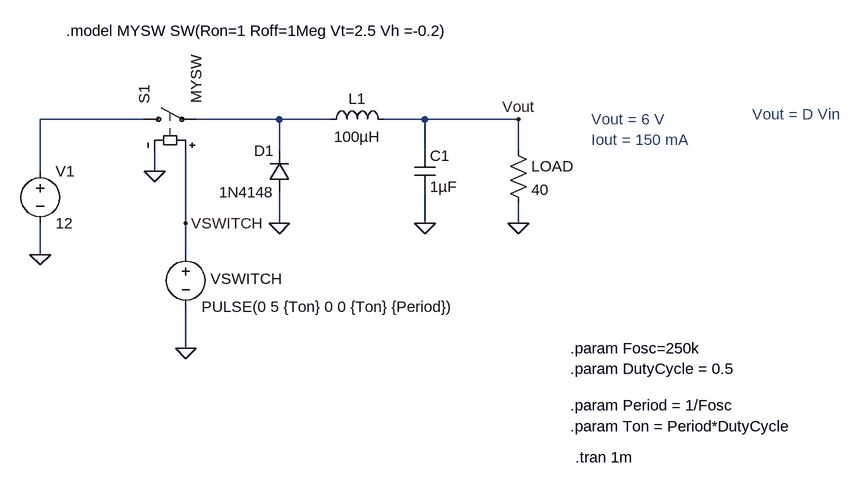
[diagram p0: schematic Buck (Step-Down) Converter Design.asc]
Buck (Step-Down) Converter Design.asc, the LTspice schematic file:
Version 4
SHEET 1 1188 680
WIRE 80 96 -80 96
WIRE 288 96 160 96
WIRE 368 96 288 96
WIRE 512 96 448 96
WIRE 656 96 512 96
WIRE 288 144 288 96
WIRE 512 144 512 96
WIRE 656 144 656 96
WIRE -80 176 -80 96
WIRE 96 176 96 144
WIRE 144 256 144 144
WIRE 288 256 288 208
WIRE 512 256 512 208
WIRE 656 256 656 224
WIRE -80 304 -80 256
WIRE 144 304 144 256
WIRE 144 448 144 384
FLAG -80 304 0
FLAG 96 176 0
FLAG 144 448 0
FLAG 288 256 0
FLAG 512 256 0
FLAG 656 256 0
FLAG 656 96 Vout
FLAG 144 256 VSWITCH
SYMBOL voltage -80 160 R0
WINDOW 123 0 0 Left 0
WINDOW 39 0 0 Left 0
SYMATTR InstName V1
SYMATTR Value 12
SYMBOL sw 64 96 R270
SYMATTR InstName S1
SYMATTR Value MYSW
SYMBOL voltage 144 288 R0
WINDOW 0 38 53 Left 2
WINDOW 123 0 0 Left 0
WINDOW 39 0 0 Left 0
SYMATTR InstName VSWITCH
SYMATTR Value PULSE(0 5 {Ton} 0 0 {Ton} {Period})
SYMBOL ind 352 112 R270
WINDOW 0 32 56 VTop 2
WINDOW 3 5 56 VBottom 2
SYMATTR InstName L1
SYMATTR Value 100µH
SYMBOL diode 304 208 R180
WINDOW 0 24 64 Left 2
WINDOW 3 24 0 Left 2
SYMATTR InstName D1
SYMATTR Value 1N4148
SYMBOL cap 496 144 R0
SYMATTR InstName C1
SYMATTR Value 1µF
SYMBOL res 640 128 R0
SYMATTR InstName LOAD
SYMATTR Value 40
TEXT 736 448 Left 2 !.param Fosc=250k
TEXT 736 480 Left 2 !.param DutyCycle = 0.5
TEXT 736 536 Left 2 !.param Period = 1/Fosc
TEXT 736 568 Left 2 !.param Ton = Period*DutyCycle
TEXT 744 616 Left 2 !.tran 1m
TEXT -40 -40 Left 2 !.model MYSW SW(Ron=1 Roff=1Meg Vt=2.5 Vh =-0.2)
TEXT 768 96 Left 2 ;Vout = 6 V\nIout = 150 mA
TEXT 1016 88 Left 2 ;Vout = D Vin

The netlist it stands for:
* Buck (Step-Down) Converter Design.asc
V1 N001 0 12
S1 N001 N002 VSWITCH 0 MYSW
VSWITCH VSWITCH 0 PULSE(0 5 {Ton} 0 0 {Ton} {Period})
L1 N002 Vout 100µH
D1 0 N002 1N4148
C1 Vout 0 1µF
R§LOAD Vout 0 40
.model D D
.lib standard.dio
.param Fosc=250k
.param DutyCycle = 0.5
.param Period = 1/Fosc
.param Ton = Period*DutyCycle
.tran 1m
.model MYSW SW(Ron=1 Roff=1Meg Vt=2.5 Vh =-0.2)
* Vout = 6 V
* Iout = 150 mA
* Vout = D Vin
.backanno
.end